# Altium schematic sheet power_reg.SchDoc
size A4; SheetNumber: 1; SheetTotal: 3
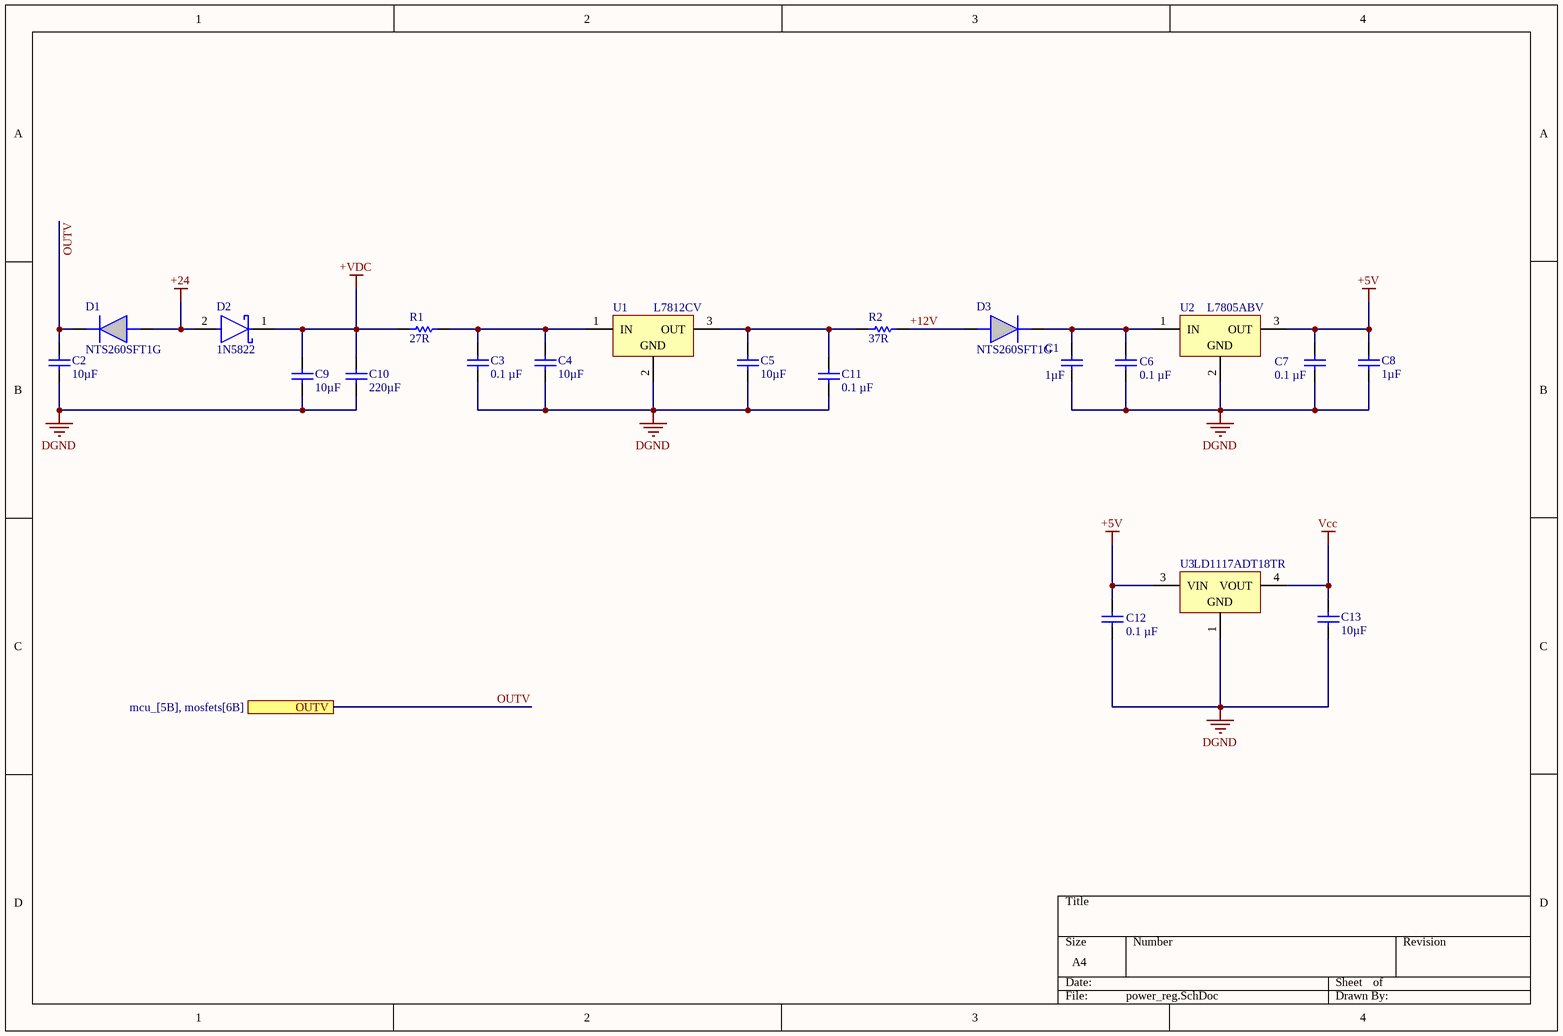
[diagram p0: power_reg.SchDoc]

## Parts
C1  Capacitance: 1µF  [0603cap]  (hidden comment: CAP CER 1UF 25V X7R 0603)
C2  Capacitance: 10µF  [CAPC2012X140N - duplicate]  (hidden comment: CAP CER 10UF 25V X5R 0805)
C3  Capacitance: 0.1 µF  [0603cap]  (hidden comment: CAP CER 0.1UF 25V X7R 0603)
C4  Capacitance: 10µF  [0603cap]  (hidden comment: CAP CER 10UF 25V X5R 0805)
C5  Capacitance: 10µF  [CAPC2012X140N - duplicate]  (hidden comment: CAP CER 10UF 25V X5R 0805)
C6  Capacitance: 0.1 µF  [0603cap]  (hidden comment: CAP CER 0.1UF 25V X7R 0603)
C7  Capacitance: 0.1 µF  [0603cap]  (hidden comment: CAP CER 0.1UF 25V X7R 0603)
C8  Capacitance: 1µF  [0603cap]  (hidden comment: CAP CER 1UF 25V X7R 0603)
C9  Capacitance: 10µF  [CAPC2012X140N - duplicate]  (hidden comment: CAP CER 10UF 25V X5R 0805)
C10  Capacitance: 220µF  [CAPC2012X140N - duplicate]  (hidden comment: CAP CER 10UF 25V X5R 0805)
C11  Capacitance: 0.1 µF  [0603cap]  (hidden comment: CAP CER 0.1UF 25V X7R 0603)
C12  Capacitance: 0.1 µF  [0603cap]  (hidden comment: CAP CER 0.1UF 25V X7R 0603)
C13  Capacitance: 10µF  [CAPC2012X140N]  (hidden comment: CAP CER 10UF 25V X5R 0805)
D1  NTS260SFT1G  [SODFL3616X98N]
D2  1N5822  [FP-DO-201AD-MFG]
D3  NTS260SFT1G  [SODFL3616X98N]
R1  Resistance: 27R  [0603 RES]  (hidden comment: RC0603JR-0727RL)
R2  Resistance: 37R  [0603 RES]  (hidden comment: RC0603JR-0727RL)
U1  L7812CV  [TO220]
U2  L7805ABV  [TO220]
U3  LD1117ADT18TR  [TO-252_N]

## Ports
OUTV (see mcu_[5B], mosfets[6B])

## Nets
+5V: C7.2 C8.2 C12.2 U2.3(OUT) U3.3(VIN)
+24: D1.2(A) D2.2(A)
+VDC: C9.2 C10.2 D2.1(C) R1.1
DGND: C1.1 C2.1 C3.1 C4.1 C5.1 C6.1 C7.1 C8.1 C9.1 C10.1 C11.1 C12.1 C13.1 U1.2(GND) U2.2(GND) U3.1(GND)
Vcc: C13.2 U3.4(VOUT)
+12V: D3.2(A) R2.1
OUTV: C2.2 D1.1(K) ; port OUTV
NetC1_2: C1.2 C6.2 D3.1(K) U2.1(IN)
NetC3_2: C3.2 C4.2 R1.2 U1.1(IN)
NetC5_2: C5.2 C11.2 R2.2 U1.3(OUT)

## Library data of the parts
C1 C8 = CAP CER 1UF 25V X7R 0603: 1 µF ±10% 25V Ceramic Capacitor X7R 0603 (1608 Metric); Manufacturer: Samsung Electro-Mechanics; Manufacturer PN: CL10B105KA8NNNC; Supplier PN: 1276-1184-1-ND; Supplier: Digikey; Supplier 1: Digi-Key; Supplier Part Number 1: 1276-1184-1-ND
C2 C4 C5 C9 C10 C13 = CAP CER 10UF 25V X5R 0805: 10 µF ±20% 25V Ceramic Capacitor X5R 0805 (2012 Metric); Supplier 1: Digi-Key; Supplier Part Number 1: 490-10748-1-ND
C3 C6 C7 C11 C12 = CAP CER 0.1UF 25V X7R 0603: 0.1 µF ±5% 25V Ceramic Capacitor X7R 0603 (1608 Metric); Manufacturer PN: C0603C104J3RACAUTO; Supplier 1: Digi-Key; Supplier Part Number 1: 399-12996-1-ND; Supplier PN: 399-12996-1-ND
D1 D3 = NTS260SFT1G: Fine Lithography Trenchbased Schottky Technology for Very Low Forward Voltage and Low Leakage; Fast Switching with Exceptional Temperature Stability; Low Power Loss and Lower Operating Temperature; Higher Efficiency for Achieving Regulatory Compliance; Low Thermal Resistance; High Surge Capability; These are PbFree and HalideFree Devices; Manufacturer_Name: onsemi; Geometry.Height: 0.98mm; Manufacturer_Part_Number: NTS260SFT1G; Mouser Part Number: 863-NTS260SFT1G; Mouser Price/Stock: https://www.mouser.co.uk/ProductDetail/onsemi/NTS260SFT1G?qs=k6dkFvHqcvCML1heMZjMng%3D%3D; Arrow Part Number: NTS260SFT1G; Arrow Price/Stock: https://www.arrow.com/en/products/nts260sft1g/on-semiconductor; Datasheet Link: https://www.onsemi.com/pub/Collateral/NTS260SF-D.PDF
D2 = CMP-12187-000025-1: DIODE SCHOTTKY 40V 3A DO201AD; Manufacturer: STMicroelectronics; Max Junction Temp: +150°C; Peak Reverse Current: 2mA; Max Surge Forward Current: 80A; Temperature Range High: +150°C; Automotive: No; RoHS: TRUE; ComponentLink2Description: Datasheet; Manufacturer Part Number: 1N5822; Lead Free: Yes; Octopart: https://octopart.com/1n5822-stmicroelectronics-323225; Device Class L2: Diodes; Max Repetitive Reverse Voltage: 40V; Temperature: to +150°C; Height: 5.3mm; Category: Diode; Digikey Description: DIODE SCHOTTKY 40V 3A DO201AD; ComponentLink2URL: https://www.st.com/resource/en/datasheet/1n5822.pdf; Device Class L3: Schottky Diodes; Device Class L1: Discrete Semiconductors; Forward Current: 3A; Mouser Description: Schottky Diodes & Rectifiers Vr/40V Io/3A BULK; Package: DO-201AD
R1 R2 = RES 27 OHM 5% 1/10W 0603: Manufacturer: YAGEO; Supplier PN: 311-27GRCT-ND; Supplier: DIGIKEY; ComponentLink1Description: Supplier Link; ComponentLink1URL: 0R; Manufacturer PN: RC0603JR-0727RL; Supplier 1: Digi-Key; Supplier Part Number 1: 311-27GRCT-ND
U1 = CMP-0244-00450-1: Positive Voltage Regulator, 12V, 3-Pin TO-220; PackageDescription: TO, Thru-Hole, Vertical, Heatsink Mounted; 3 In-Line Leads; Pitch 2.54 mm; ComponentLink3URL: http://www.st.com/internet/com/TECHNICAL_RESOURCES/TECHNICAL_LITERATURE/PACKAGE_INFORMATION/CD00004649.pdf; ComponentLink1URL: http://www.st.com; ComponentLink2Description: Datasheet; ComponentLink3Description: Package Specification; ComponentLink2URL: http://www.st.com/internet/com/TECHNICAL_RESOURCES/TECHNICAL_LITERATURE/DATASHEET/CD00000444.pdf; DatasheetVersion: 16/11/2011; PackageVersion: ver3.0; PackageReference: TO220; ComponentLink1Description: Manufacturer URL
U2 = CMP-0244-00485-1: Positive Voltage Regulator, 5V, 3-Pin TO-220; ComponentLink1URL: http://www.st.com; PackageDescription: TO, Thru-Hole, Vertical, Heatsink Mounted; 3 In-Line Leads; Pitch 2.54 mm; DatasheetVersion: 16/11/2011; ComponentLink2Description: Datasheet; ComponentLink1Description: Manufacturer URL; PackageReference: TO220; ComponentLink3Description: Package Specification; ComponentLink2URL: http://www.st.com/internet/com/TECHNICAL_RESOURCES/TECHNICAL_LITERATURE/DATASHEET/CD00000444.pdf; ComponentLink3URL: http://www.st.com/internet/com/TECHNICAL_RESOURCES/TECHNICAL_LITERATURE/PACKAGE_INFORMATION/CD00004649.pdf; PackageVersion: ver3.0
U3 = CMP-0244-00136-1: 1A, Low Drop Positive Voltage Regulator, 1.8V, 3-Pin DPAK, Tape and Reel; DatasheetVersion: 2/12/2011; ComponentLink1Description: Manufacturer URL; ComponentLink1URL: http://www.st.com; ComponentLink2Description: Datasheet; PackageVersion: 2011; ComponentLink2URL: http://www.st.com/internet/com/TECHNICAL_RESOURCES/TECHNICAL_LITERATURE/DATASHEET/CD00002116.pdf; PackageReference: TO-252; PackageDescription: 3-Pin Transistor Outline Package 2.28 mm Pitch, 9.7 mm Lead Span (DPAK)